# Altium schematic sheet Charge Station.SchDoc
size Tabloid
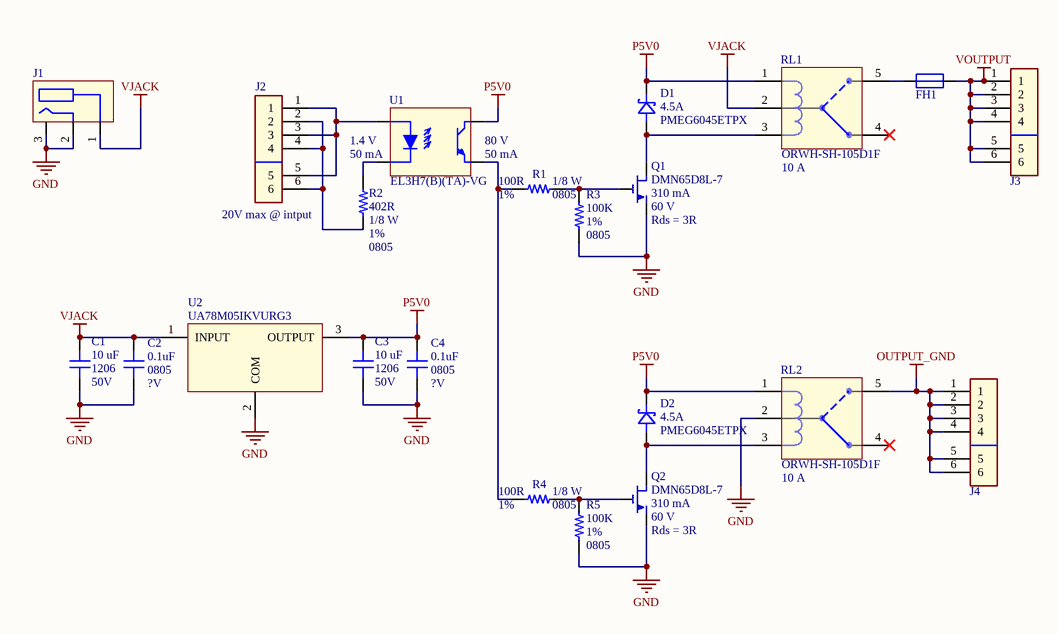
[diagram p0: Charge Station.SchDoc]

## Parts
C1  value 10 uF  Package: 1206  Voltage: 50V  [CAP_1206]  (hidden comment: CAP - 1206)
C2  value 0.1uF  Package: 0805  Voltage: ?V  [CAP_0805]  (hidden comment: CAP - 0805)
C3  value 10 uF  Package: 1206  Voltage: 50V  [CAP_1206]  (hidden comment: CAP - 1206)
C4  value 0.1uF  Package: 0805  Voltage: ?V  [CAP_0805]  (hidden comment: CAP - 0805)
D1  Current: 4.5A  Part number: PMEG6045ETPX  [DO-214AC_SOD128]  (hidden comment: SCHOTTKEY)
D2  Current: 4.5A  Part number: PMEG6045ETPX  [DO-214AC_SOD128]  (hidden comment: SCHOTTKEY)
FH1  FH 3AB-3AG  [FH_3AB_3AG]  (value not drawn)
J1  Barrel 5.5x2.5mm  [Barrel 5.5mm 2.5mm]  (value not drawn)
J2  MOLEX 4 POS - TERMINAL BLOCK 2 POS  [MOLEX4POS_TERMBLOCK2POS]  (value not drawn)
J3  MOLEX 4 POS - TERMINAL BLOCK 2 POS  [MOLEX4POS_TERMBLOCK2POS]  (value not drawn)
J4  MOLEX 4 POS - TERMINAL BLOCK 2 POS  [MOLEX4POS_TERMBLOCK2POS]  (value not drawn)
Q1  Part number: DMN65D8L-7  A max: 310 mA  Vds max: 60 V  Ron: Rds = 3R  [SOT-23]  (hidden comment: NMOS)
Q2  Part number: DMN65D8L-7  A max: 310 mA  Vds max: 60 V  Ron: Rds = 3R  [SOT-23]  (hidden comment: NMOS)
R1  value 100R  Watt: 1/8 W  Tolerance: 1%  Package: 0805  [RES_0805]  (hidden comment: RES - 0805)
R2  value 402R  Watt: 1/8 W  Tolerance: 1%  Package: 0805  [RES_0805]  (hidden comment: RES - 0805)
R3  value 100K  Tolerance: 1%  Package: 0805  [RES_0805]  (hidden comment: RES - 0805)
R4  value 100R  Watt: 1/8 W  Tolerance: 1%  Package: 0805  [RES_0805]  (hidden comment: RES - 0805)
R5  value 100K  Tolerance: 1%  Package: 0805  [RES_0805]  (hidden comment: RES - 0805)
RL1  Part number: ORWH-SH-105D1F  A max: 10 A  [ORWH-SH]  (hidden comment: Relay SPDT)
RL2  Part number: ORWH-SH-105D1F  A max: 10 A  [ORWH-SH]  (hidden comment: Relay SPDT)
U1  Part number: EL3H7(B)(TA)-VG  Max Vf: 1.4 V  Max output current: 50 mA  Voutput MAX: 80 V  [SOIC127P700X200-4M]  (hidden comment: Optoisolator)
U2  Part number: UA78M05IKVURG3  [DPAK229P991X252-3N]  (hidden comment: UA78M)

## Nets
GND: C1.2 C2.2 C3.2 C4.2 J1.2 J1.3 Q1.1 Q2.1 R3.1 R5.1 RL2.2 U2.2(COM)
OUTPUT_GND: J4.1 J4.2 J4.3 J4.4 J4.5 J4.6 RL2.5
P5V0: C3.1 C4.1 D1.2 D2.2 RL1.1 RL2.1 U1.4 U2.3(OUTPUT)
VJACK: C1.1 C2.1 J1.1 RL1.2 U2.1(INPUT)
VOUTPUT: FH1.1 J3.1 J3.2 J3.3 J3.4 J3.5 J3.6
NetD1_1: D1.1 Q1.3 RL1.3
NetD2_1: D2.1 Q2.3 RL2.3
NetFH1_2: FH1.2 RL1.5
NetJ2_1: J2.1 J2.3 J2.5 U1.1
NetJ2_2: J2.2 J2.4 J2.6 R2.1
NetQ1_2: Q1.2 R1.2 R3.2
NetQ2_2: Q2.2 R4.2 R5.2
NetR1_1: R1.1 R4.1 U1.3
NetR2_2: R2.2 U1.2

Not connected (* = marked no-connect by the designer): RL1 4*; RL2 4*

## Notes on the sheet
- (near J2) 20V max @ intput
- Sheet Name
- Project Title
- Global Project
- Size
- Group
- Revision
- Date
- Sheet
- of
- Filename
- Designers

## Library data of the parts
C1 C3 = CAP - 1206: Part number: GRT31CR61H106ME01L
C2 C4 = CAP - 0805: Part number: CC0805KRX7R9BB104
D1 D2 = SCHOTTKEY: Vf: Vf =0.33V
FH1 = FH 3AB-3AG: Fuse holder (3AB-3AG); Part number: 01020071Z x2
J1 = Barrel 5.5x2.5mm: Jack 5.5x2.5mm; Part number: PJ-082BH
J2-J4 = MOLEX 4 POS - TERMINAL BLOCK 2 POS: Part number: 0039281043; Part number: OSTOQ023250
R1 R4 = RES - 0805: Part number: ERA-6AEB101V
R2 = RES - 0805: Part number: ERA-6AEB4020V
R3 R5 = RES - 0805: Part number: RMCF0805FT100K; Watt: 1/8 W
RL1 = Relay SPDT: pin to pad: 1>3 3>1
U1 = Optoisolator: Max IF: 50 mA